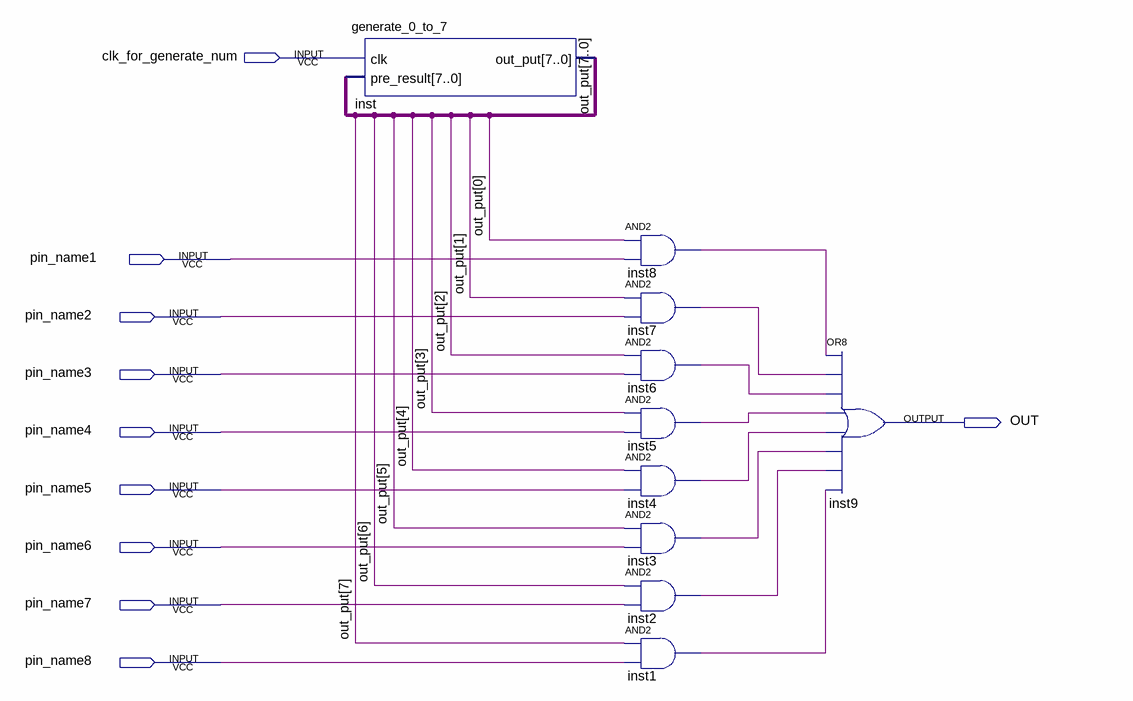
[diagram p0: schematic sheet]
// Quartus schematic Block1.bdf as structural Verilog: 10 symbols, 10 pins
module Block1 (
  input  clk_for_generate_num,
  input  pin_name1,
  input  pin_name2,
  input  pin_name3,
  input  pin_name4,
  input  pin_name5,
  input  pin_name6,
  input  pin_name7,
  input  pin_name8,
  output OUT
);

  wire inst1_out, inst2_out, inst3_out, inst4_out, inst5_out, inst6_out, inst7_out, inst8_out;
  wire [7:0] out_put;

  generate_0_to_7 inst (.clk(clk_for_generate_num), .pre_result(out_put), .out_put(out_put));
  and inst8 (inst8_out, out_put[0], pin_name1);
  and inst7 (inst7_out, out_put[1], pin_name2);
  and inst6 (inst6_out, out_put[2], pin_name3);
  and inst5 (inst5_out, out_put[3], pin_name4);
  and inst4 (inst4_out, out_put[4], pin_name5);
  and inst3 (inst3_out, out_put[5], pin_name6);
  and inst2 (inst2_out, out_put[6], pin_name7);
  and inst1 (inst1_out, out_put[7], pin_name8);
  or inst9 (OUT, inst8_out, inst7_out, inst6_out, inst5_out, inst4_out, inst3_out, inst2_out, inst1_out);
endmodule
